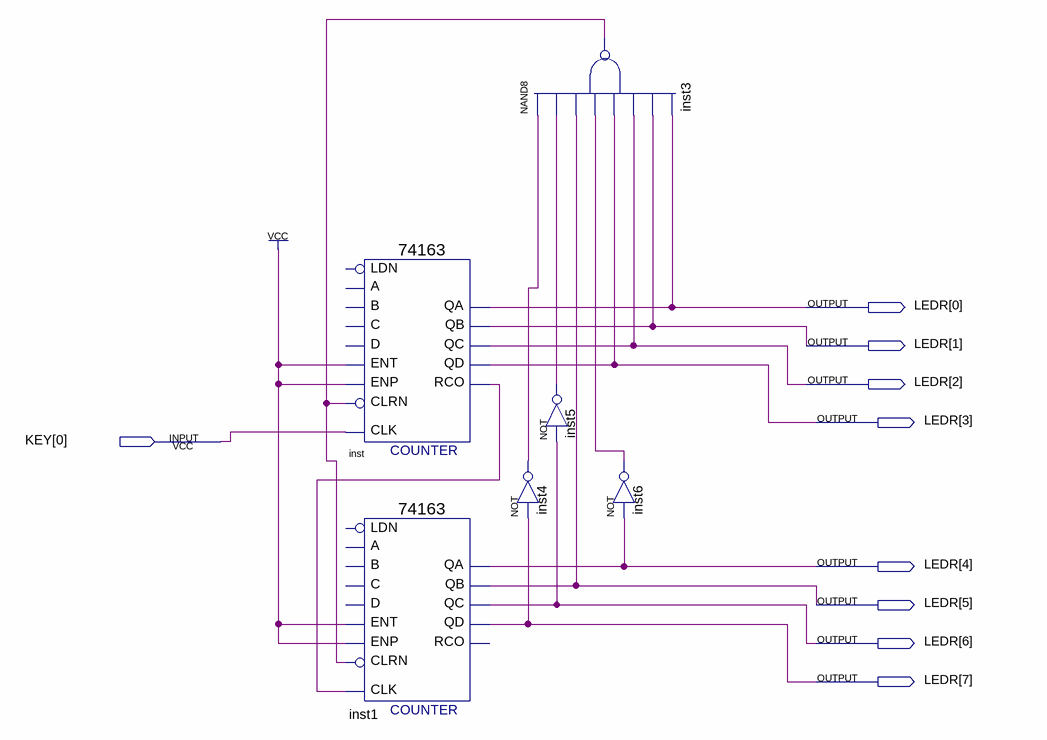
[diagram p0: schematic sheet]
// Quartus schematic lab33.bdf as structural Verilog: 6 symbols, 9 pins
module lab33 (
  input  [0:0] KEY,
  output [7:0] LEDR
);

  wire inst3_out, inst4_out, inst5_out, inst6_out, inst_rco;

  \74163  inst (
    .ENT(1'b1), .CLRN(inst3_out), .CLK(KEY[0]), .ENP(1'b1), .QA(LEDR[0]), .QB(LEDR[1]), .QC(LEDR[2]),
    .QD(LEDR[3]), .RCO(inst_rco));  // open: C, B, A, D, LDN
  \74163  inst1 (
    .ENT(1'b1), .CLRN(inst3_out), .CLK(inst_rco), .ENP(1'b1), .QA(LEDR[4]), .QB(LEDR[5]), .QC(LEDR[6]),
    .QD(LEDR[7]));  // open: C, B, A, D, LDN, RCO
  nand inst3 (inst3_out, inst4_out, inst5_out, LEDR[5], inst6_out, LEDR[3], LEDR[2], LEDR[1], LEDR[0]);
  not inst4 (inst4_out, LEDR[7]);
  not inst5 (inst5_out, LEDR[6]);
  not inst6 (inst6_out, LEDR[4]);
endmodule
